# Altium schematic sheet Weathe_Station.SchDoc
size A4
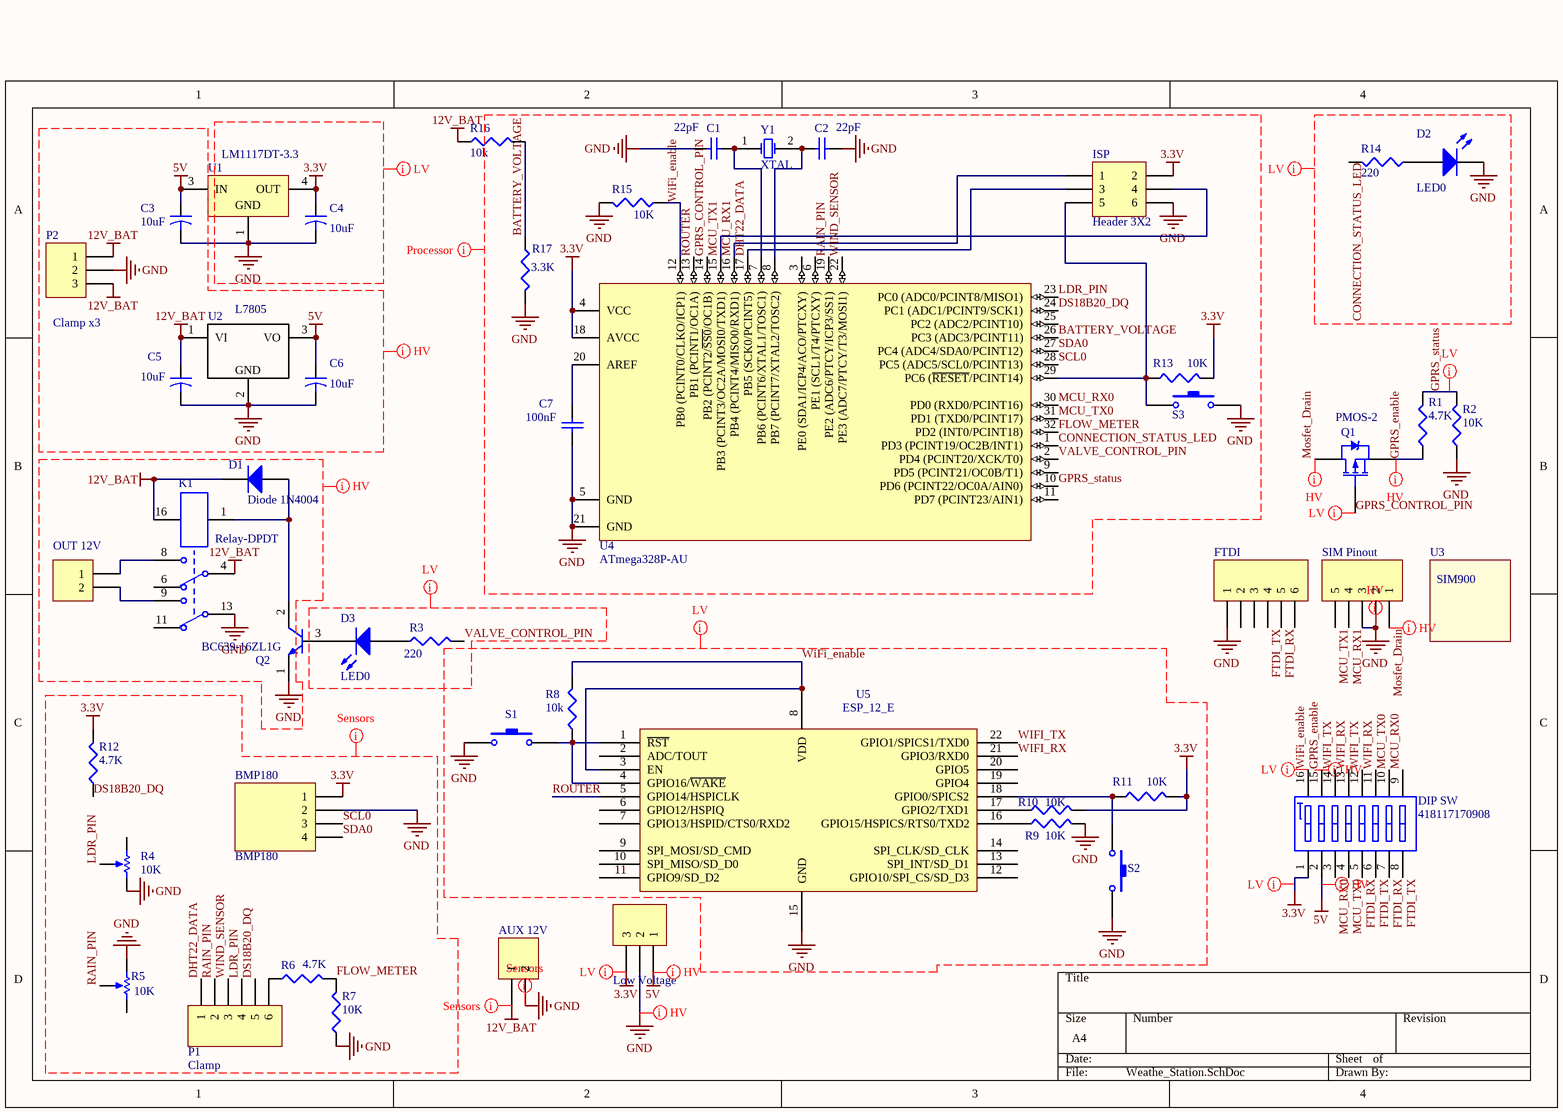
[diagram p0: Weathe_Station.SchDoc]

## Parts
AUX_12V  AUX 12V  [Connector (Clamp?)]  (value not drawn)
BMP180  BMP180  [BMP180]
C1  value 22pF  [C1206]  (hidden comment: Cap Semi)
C2  value 22pF  [C1206]  (hidden comment: Cap Semi)
C3  value 10uF  [CAPR5-4X5]  (hidden comment: Cap2)
C4  value 10uF  [CAPR5-4X5]  (hidden comment: Cap2)
C5  value 10uF  [CAPR5-4X5]  (hidden comment: Cap2)
C6  value 10uF  [CAPR5-4X5]  (hidden comment: Cap2)
C7  value 100nF  [C1206]  (hidden comment: Cap Semi)
D1  Diode 1N4004  [DO-41]
D2  LED0  [INDC3216]
D3  LED0  [INDC3216]
DIP_SW  418117170908  [418117170908]
FTDI  Header 6  [HDR1X6]  (value not drawn)
ISP  Header 3X2  [HDR2X3]
K1  Relay-DPDT  [Sanyou Relay]
Low_Voltage  Clamp x3  [Connector x3 clamps]  (value not drawn)
OUT_12V  Homemade Connector  [Connector (Clamp?)]  (value not drawn)
P1  Clamp  [Connector Clamp (x6)]
P2  Clamp x3  [Connector x3 clamps]
Q1  PMOS-2  [TO-220AB]
Q2  BC639-16ZL1G  [ONSC-TO-92-3-29-11_AM_BL]
R1  value 4.7K  [smd resistor 4x2mm]  (hidden comment: smd resistor 4x2mm)
R2  value 10K  [smd resistor 4x2mm]  (hidden comment: smd resistor 4x2mm)
R3  value 220  [smd resistor 4x2mm]  (hidden comment: smd resistor 4x2mm)
R4  value 10K  [potentiometer (Piher)]  (hidden comment: RPot)
R5  value 10K  [potentiometer (Piher)]  (hidden comment: RPot)
R6  value 4.7K  [smd resistor 4x2mm]  (hidden comment: smd resistor 4x2mm)
R7  value 10K  [smd resistor 4x2mm]  (hidden comment: smd resistor 4x2mm)
R8  value 10k  [smd resistor 4x2mm]  (hidden comment: smd resistor)
R9  value 10K  [smd resistor 4x2mm]  (hidden comment: smd resistor 4x2mm)
R10  value 10K  [smd resistor 4x2mm]  (hidden comment: smd resistor 4x2mm)
R11  value 10K  [smd resistor 4x2mm]  (hidden comment: smd resistor 4x2mm)
R12  value 4.7K  [smd resistor 4x2mm]  (hidden comment: smd resistor 4x2mm)
R13  value 10K  [smd resistor 4x2mm]  (hidden comment: smd resistor 4x2mm)
R14  value 220  [smd resistor 4x2mm]  (hidden comment: smd resistor 4x2mm)
R15  value 10K  [smd resistor 4x2mm]  (hidden comment: smd resistor 4x2mm)
R16  value 10k  [smd resistor 4x2mm]  (hidden comment: smd resistor 4x2mm)
R17  value 3.3K  [smd resistor 4x2mm]  (hidden comment: smd resistor 4x2mm)
S1  SW-PB  [SMD push button 10x4]  (value not drawn)
S2  SW-PB  [SMD push button 10x4]  (value not drawn)
S3  SW-PB  [SMD push button 10x4]  (value not drawn)
SIM_Pinout  Header 5  [HDR1X5]  (value not drawn)
U1  LM1117DT-3.3  [TD03B_N]
U2  L7805  [D2PAK]
U3  SIM900  [SIM900]
U4  ATmega328P-AU  [32A_L]
U5  ESP_12_E  [ESP_12_E]
Y1  XTAL  [R38]

## Nets
3.3V: BMP180.1 C4.1 DIP_SW.1 ISP.2 Low_Voltage.3 R10.2 R11.2 R12.2 R13.2 U1.4(OUT) U4.4(VCC) U4.18(AVCC)
5V: C3.1 C6.1 DIP_SW.2 Low_Voltage.1 U1.3(IN) U2.3(VO)
12V_BAT: AUX_12V.1 C5.1 D1.2(K) K1.4 K1.16 P2.1 P2.3 R16.1 U2.1(VI)
GND: AUX_12V.2 BMP180.2 C1.1 C2.2 C3.2 C4.2 C5.2 C6.2 C7.1 D2.2(K) FTDI.1 ISP.6 K1.13 Low_Voltage.2 P2.2 Q2.1(E) R2.1 R4.2(BOT) R5.1(TOP) R7.1 R9.2 R15.2 R17.2 S1.1 S2.2 S3.2 SIM_Pinout.2 SIM_Pinout.3 U1.1(GND) U2.2 U4.5(GND) U4.21(GND) U5.15(GND)
BATTERY_VOLTAGE: R16.2 R17.1 U4.26(PC3_(ADC3/PCINT11))
CONNECTION_STATUS_LED: R14.2 U4.1(PD3_(PCINT19/OC2B/INT1))
DHT22_DATA: ISP.3 P1.1 U4.17(PB5_(SCK0/PCINT5))
DS18B20_DQ: P1.5 R12.1 U4.24(PC1_(ADC1/PCINT9/SCK1))
FLOW_METER: R6.2 R7.2 U4.32(PD2_(INT0/PCINT18))
FTDI_RX: DIP_SW.5 DIP_SW.7 FTDI.5
FTDI_TX: DIP_SW.6 DIP_SW.8 FTDI.4
GPRS_CONTROL_PIN: Q1.1(G) U4.14(PB2_(PCINT2/~{SS0}/OC1B))
GPRS_enable: DIP_SW.15 Q1.3(S) R1.1
GPRS_status: R1.2 R2.2 U4.10(PD6_(PCINT22/OC0A/AIN0))
LDR_PIN: P1.4 R4.3(TAP) U4.23(PC0_(ADC0/PCINT8/MISO1))
MCU_RX0: DIP_SW.3 DIP_SW.9 U4.30(PD0_(RXD0/PCINT16))
MCU_RX1: ISP.1 SIM_Pinout.4 U4.16(PB4_(PCINT4/MISO0/RXD1))
MCU_TX0: DIP_SW.4 DIP_SW.10 U4.31(PD1_(TXD0/PCINT17))
MCU_TX1: ISP.4 SIM_Pinout.5 U4.15(PB3_(PCINT3/OC2A/MOSI0/TXD1))
Mosfet_Drain: Q1.2(D) SIM_Pinout.1
RAIN_PIN: P1.2 R5.3(TAP) U4.19(PE2_(ADC6/PTCY/ICP3/SS1))
ROUTER: U4.13(PB1_(PCINT1/OC1A)) U5.5(GPIO14/HSPICLK)
SCL0: BMP180.3 U4.28(PC5_(ADC5/SCL0/PCINT13))
SDA0: BMP180.4 U4.27(PC4_(ADC4/SDA0/PCINT12))
VALVE_CONTROL_PIN: R3.2 U4.2(PD4_(PCINT20/XCK/T0))
WiFi_enable: DIP_SW.16 R8.2 R15.1 U4.12(PB0_(PCINT0/CLKO/ICP1)) U5.3(EN) U5.8(VDD)
WIFI_RX: DIP_SW.11 DIP_SW.13 U5.21(GPIO3/RXD0)
WIFI_TX: DIP_SW.12 DIP_SW.14 U5.22(GPIO1/SPICS1/TXD0)
WIND_SENSOR: P1.3 U4.22(PE3_(ADC7/PTCY/T3/MOSI1))
NetC1_2: C1.2 U4.7(PB6_(PCINT6/XTAL1/TOSC1)) Y1.1(OSC1)
NetC2_1: C2.1 U4.8(PB7_(PCINT7/XTAL2/TOSC2)) Y1.2(OSC2)
NetC7_2: C7.2 U4.20(AREF)
NetD1_1: D1.1(A) K1.1 Q2.2(C)
NetD2_1: D2.1(A) R14.1
NetD3_1: D3.1(A) R3.1
NetD3_2: D3.2(K) Q2.3(B)
NetISP_5: ISP.5 R13.1 S3.1 U4.29(PC6_(~{RESET}/PCINT14))
NetK1_8: K1.8 OUT_12V.1
NetK1_9: K1.9 OUT_12V.2
NetP1_6: P1.6 R6.1
NetR8_1: R8.1 S1.2 U5.1(~{RST}) U5.4(GPIO16/~{WAKE})
NetR9_1: R9.1 U5.16(GPIO15/HSPICS/RTS0/TXD2)
NetR10_1: R10.1 U5.17(GPIO2/TXD1)
NetR11_1: R11.1 S2.1 U5.18(GPIO0/SPICS2)

Not connected (* = marked no-connect by the designer): FTDI 2 3 6; K1 6 11; R4 1(TOP); R5 2(BOT); U4 3(PE0_(SDA1/ICP4/ACO/PTCXY)) 6(PE1_(SCL1/T4/PTCXY)) 9(PD5_(PCINT21/OC0B/T1)) 11(PD7_(PCINT23/AIN1)) 25(PC2_(ADC2/PCINT10)); U5 2(ADC/TOUT) 6(GPIO12/HSPIQ) 7(GPIO13/HSPID/CTS0/RXD2) 9(SPI_MOSI/SD_CMD) 10(SPI_MISO/SD_D0) 11(GPIO9/SD_D2) 12(GPIO10/SPI_CS/SD_D3) 13(SPI_INT/SD_D1) 14(SPI_CLK/SD_CLK) 19(GPIO4) 20(GPIO5)

## Layout directives
net class HV: 5V, 12V_BAT, (no net found under the mark), GND, GPRS_enable, Mosfet_Drain
net class Processor: 3.3V, BATTERY_VOLTAGE, CONNECTION_STATUS_LED, DHT22_DATA, DS18B20_DQ, FLOW_METER, GND, GPRS_CONTROL_PIN, GPRS_status, LDR_PIN, MCU_RX0, MCU_RX1, MCU_TX0, MCU_TX1, RAIN_PIN, ROUTER, SCL0, SDA0, VALVE_CONTROL_PIN, WiFi_enable, WIND_SENSOR
net class LV: 3.3V, CONNECTION_STATUS_LED, GND, GPRS_CONTROL_PIN, GPRS_status, ROUTER, VALVE_CONTROL_PIN, WiFi_enable, WIFI_RX, WIFI_TX
net class Sensors: 3.3V, 12V_BAT, DHT22_DATA, DS18B20_DQ, FLOW_METER, GND, LDR_PIN, RAIN_PIN, SCL0, SDA0, WIND_SENSOR

## Notes on the sheet
- (in symbol L7805-D2PAK) GND

## Library data of the parts
AUX_12V OUT_12V = Header 2: Klema; LatestRevisionDate: 17-Jul-2002; LatestRevisionNote: Re-released for DXP Platform.; Publisher: Altium Limited
C1 C2 C7 = Cap Semi: Capacitor (Semiconductor SIM Model); Published: 8-Jun-2000; LatestRevisionDate: 29-May-2009; LatestRevisionNote: IPC-7351 Footprint Added.; PackageReference: C1206; Publisher: Altium Limited; PackageDescription: Chip Capacitor
C3-C6 = Cap2: Capacitor; Published: 23-Sep-2002; PackageReference: CAPR5-4X5; Publisher: Altium Limited; PackageDescription: Capacitor; 2 Leads
D1 = Diode 1N4004: 1 Amp General Purpose Rectifier; Published: 8-Jun-2000; LatestRevisionDate: 17-Jul-2002; LatestRevisionNote: Re-released for DXP Platform.; DatasheetVersion: 1998; PackageVersion: Aug-1999; PackageReference: DO-41; Publisher: Altium Limited; PackageDescription: Diode, Axial; Body 5.2 x 2.7 mm (LxDia. max), Lead Dia. 0.86 mm (max); Code_JEDEC: DO-204-AL; ComponentLink1Description: Manufacturer Link; ComponentLink1URL: http://www.fairchildsemi.com/; ComponentLink2Description: Datasheet; ComponentLink2URL: http://www.fairchildsemi.com/ds/1N%2F1N4001.pdf
D2 D3 = LED0: SMD led; Published: 8-Jun-2000; LatestRevisionDate: 08-Jul-2005; LatestRevisionNote: Mech Layer 1 removed.; PackageReference: LED-0; Publisher: Altium Limited; PackageDescription: LED; 2 Leads
DIP_SW = 418117170908: 2.54 mm Compact THT Dip Switch with Flat Actuator WS-DITV; NoPins: 16; PackageReference: 418117170908; PartNumber: 418117170908; ComponentLink1Description: Manufacturer URL; ComponentLink1URL: http://www.we-online.com; ComponentLink2Description: Datasheet; ComponentLink2URL: http://katalog.we-online.de/em/datasheet/4181171709xx.pdf
FTDI P1 = Header 6: Header, 6-Pin; LatestRevisionDate: 17-Jul-2002; LatestRevisionNote: Re-released for DXP Platform.; Publisher: Altium Limited
ISP = Header 3X2: Header, 3-Pin, Dual row; LatestRevisionDate: 17-Jul-2002; LatestRevisionNote: Re-released for DXP Platform.; Publisher: Altium Limited
K1 = Relay-DPDT: Dual-Pole Dual-Throw Relay; Published: 24-Mar-1999; LatestRevisionDate: 17-Jul-2002; LatestRevisionNote: Re-released for DXP Platform.; PackageReference: DIP-P8; Publisher: Altium Limited; PackageDescription: Relay; 8 Leads
Q1 = PMOS-2: P-Channel Power MOSFET; Note: Pin 4 not drawn and electrically connected to Pin 2.; Published: 8-Jun-2000; LatestRevisionDate: 17-Jul-2002; LatestRevisionNote: Re-released for DXP Platform.; DatasheetVersion: PD-9.390D; PackageVersion: Feb-1997; PackageReference: TO-220AB; Publisher: Altium Limited; PackageDescription: TO, Thru-Hole, Vertical, Heatsink Mounted; 3 In-Line Leads; Pitch 2.54 mm; ComponentLink1Description: Manufacturer Link; ComponentLink1URL: http://www.irf.com/
Q2 = BC639-16ZL1G: High Current Transistor, NPN Silicon, 3-Pin TO-92, Pb-Free, Ammo Box; Manufacturer: On Semiconductor; IC Continuous (A): 1; DatasheetVersion: Rev. 1; PackageVersion: Rev. AM; PackageReference: TO-92-3-29-11_AM_BL; PackageDescription: 3-Pin Transistor Outline, Body 4.825 x 3.685 mm, Pitch 1.27 mm; Supplier 1: Digi-Key; Supplier Part Number 1: BC639-16ZL1GOSTB-ND; Supplier 2: Digi-Key; Supplier Part Number 2: BC639-16ZL1GOSCT-ND; Supplier 3: Farnell; Supplier Part Number 3: 2317596; Supplier 4: Newark; Supplier Part Number 4: 90W4257; Supplier 5: Newark; Supplier Part Number 5: 45J0583; Supplier 6: Mouser; Supplier Part Number 6: 863-BC639-16ZL1G; Packing: Ammo Box; Polarity: NPN; RoHS: TRUE; Mounting Technology: Through Hole; PartNumber: BC639-16ZL1G; ComponentLink1Description: Manufacturer URL; ComponentLink1URL: http://www.onsemi.com/; ComponentLink2Description: Datasheet; ComponentLink2URL: http://www.onsemi.com/pub_link/Collateral/BC635-D.PDF; ComponentLink3Description: Package Specification; ComponentLink3URL: http://www.onsemi.com/pub_link/Collateral/MAC97-D.PDF
R1-R3 R6-R17 = Res3: Published: 8-Jun-2000; LatestRevisionDate: 29-May-2009; LatestRevisionNote: IPC-7351 Footprint Added.; PackageReference: J1-0603; Publisher: Altium Limited; PackageDescription: Chip Resistor
R4 R5 = RPot: Potentiometer; Sim Note: Enter the Resistance value and the set point into parameter fields.; Set Position: 0.5; Published: 8-Jun-2000; LatestRevisionDate: 17-Jul-2002; LatestRevisionNote: Re-released for DXP Platform.; PackageReference: VR5; Publisher: Altium Limited; PackageDescription: Variable Resistor, Thru-Hole; 3 Leads
S1-S3 = SW-PB: Switch; Published: 24-Mar-1999; LatestRevisionDate: 17-Jul-2002; LatestRevisionNote: Re-released for DXP Platform.; PackageReference: SPST-2; Publisher: Altium Limited; PackageDescription: Switch; 2 Leads
SIM_Pinout = Header 5: Header, 5-Pin; LatestRevisionDate: 17-Jul-2002; LatestRevisionNote: Re-released for DXP Platform.; Publisher: Altium Limited
U1 = LM1117DT-3.3: 800mA Low-Dropout Linear Regulator, 3-pin TO-252; Manufacturer: National Semiconductor; PackageTopMarking: NSUZXYTT*LM1117*DT-3.3; PowerWise: N; CompType: LDO IC; High-Reliability: Y; DatasheetVersion: Apr-2006; PackageVersion: revD, Feb-2009; PackageReference: TD03B; PackageDescription: TO252, Molded, Jedec, 6.8 x 6.10 x 2.30mm Body, 3 Lead, 2.28mm Pitch, Surface Mount; PartNumber: LM1117DT-3.3; RoHS: N; PinCount: 3; Code_JEDEC: TO-252-AA; ComponentLink1Description: Manufacturer URL; ComponentLink1URL: http://www.national.com/; ComponentLink2Description: LM1117 Datasheet; ComponentLink2URL: http://www.national.com/ds/LM/LM1117.pdf; ComponentLink3Description: LM1117 Web Page; ComponentLink3URL: http://www.national.com/pf/LM/LM1117.html; ComponentLink4Description: TD03B Package Page; ComponentLink4URL: http://www.national.com/packaging/folders/td03b.html
U2 = L7805-D2PAK: LINEAR REGULATOR 5.0V; Supplier 1: Digi-Key; Supplier Part Number 1: 497-1170-6-ND
U4 = ATmega328P-AU: 8-bit AVR Microcontroller, 32KB Flash, 1KB EEPROM, 2KB SRAM, 32-pin TQFP, Industrial Grade (-40°C to 85°C); Published: 1-Apr-2010; DatasheetVersion: revA, Jan-2010; PackageVersion: revB, Oct-2001; PackageReference: 32A; Publisher: Altium Limited; PackageDescription: 32-Lead, 7x7x1.0 mm Body, 0.8mm Lead Pitch, Thin Profile Plastic Quad Flat Package (TQFP); Supplier 1: Digi-Key; Supplier Part Number 1: ATMEGA328P-AU-ND; Supplier 2: Farnell; Supplier Part Number 2: 1715486; Supplier 3: Mouser; Supplier Part Number 3: 556-ATMEGA328P-AU; Code_JEDEC: MS-026-ABA; ComponentLink1Description: Manufacturer Link; ComponentLink1URL: http://www.atmel.com/products/avr/default.asp?; ComponentLink2Description: ATmega48A/48PA/88A/88PA/168A/168PA/328/328P Datasheet; ComponentLink2URL: http://www.atmel.com/dyn/resources/prod_documents/8271.pdf; ComponentLink3Description: ATmega48A/48PA/88A/88PA/168A/168PA/328/328P Summary; ComponentLink3URL: http://www.atmel.com/dyn/resources/prod_documents/8271S.pdf; ComponentLink4Description: Atmel.com Home; ComponentLink4URL: http://www.atmel.com
U5 = ESP_12_E: ESP-12 Wi-Fi Module by AI-Thinker; IC: ESP8266-EX; Vendor: Ai-thinker
Y1 = XTAL: Crystal Oscillator; Published: 8-Jun-2000; LatestRevisionDate: 17-Jul-2002; LatestRevisionNote: Re-released for DXP Platform.; PackageReference: R38; Publisher: Altium Limited; PackageDescription: Crystal, Thru-Hole; 2 Leads; Body 3.1 x 8.2 mm (Dia.xH)
BMP180 = BMP180: LatestRevisionDate: 17-Jul-2002; LatestRevisionNote: Re-released for DXP Platform.; Publisher: Altium Limited
Low_Voltage P2 = Clamp x3: LatestRevisionDate: 17-Jul-2002; LatestRevisionNote: Re-released for DXP Platform.; Publisher: Altium Limited